# Altium schematic sheet HDMI.SchDoc
size A2; SheetNumber: 6; SheetTotal: 19
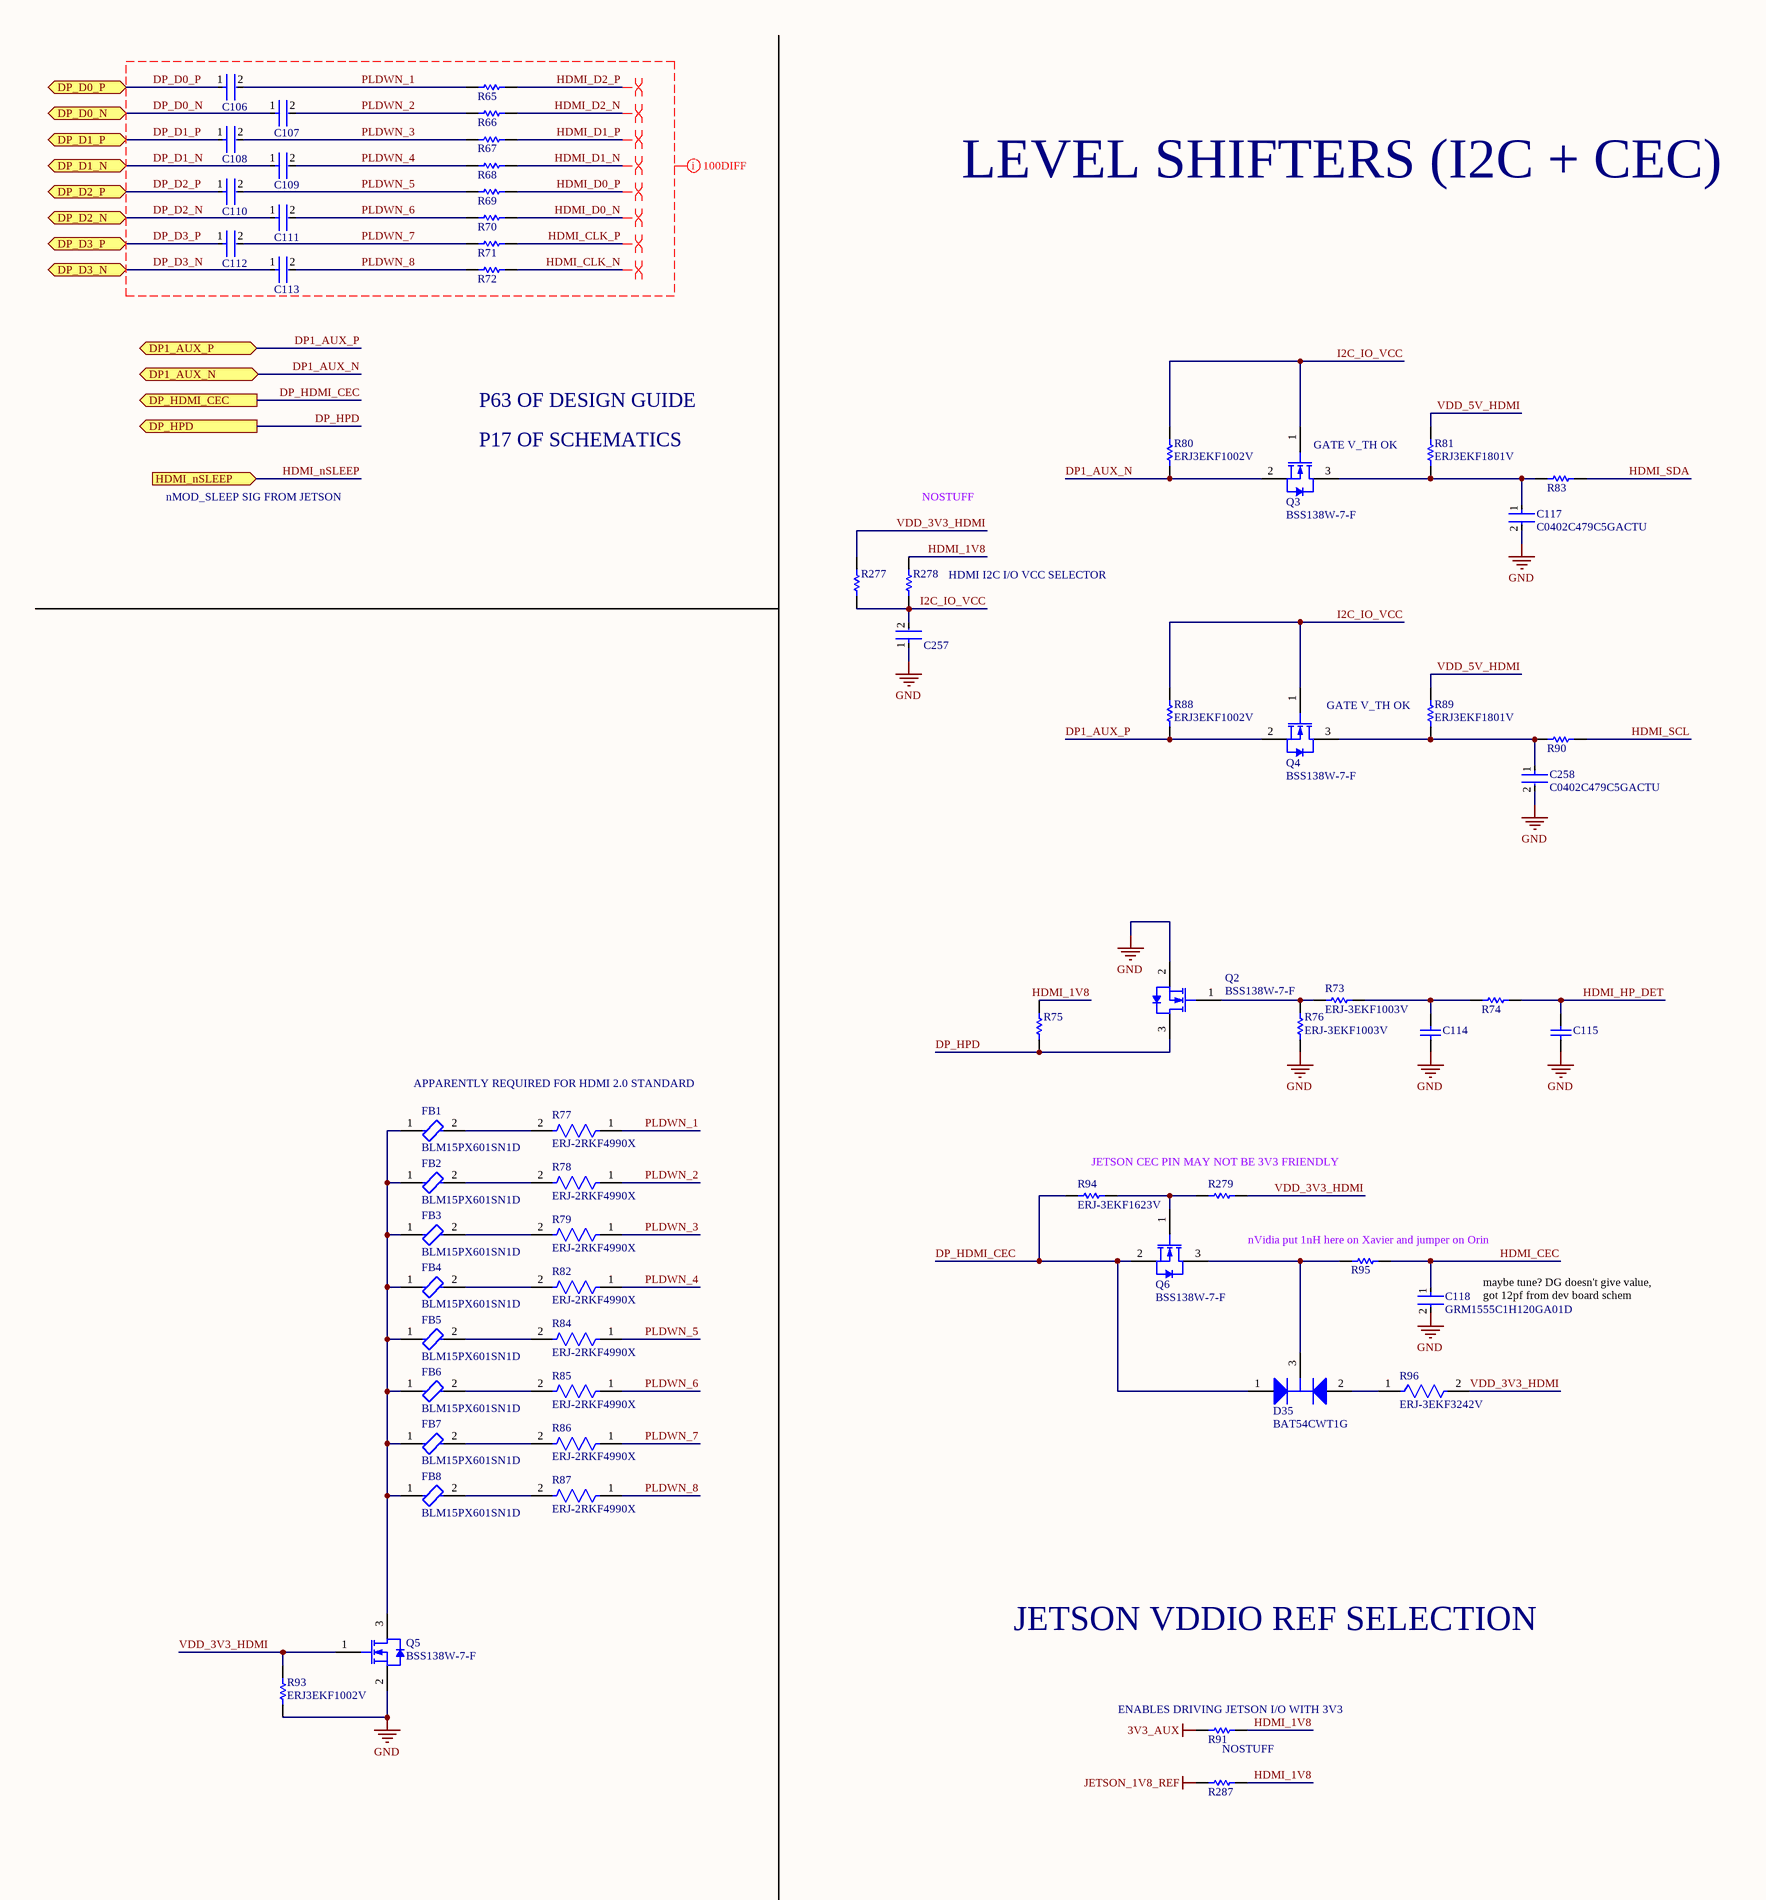
[diagram p0: HDMI.SchDoc, left]
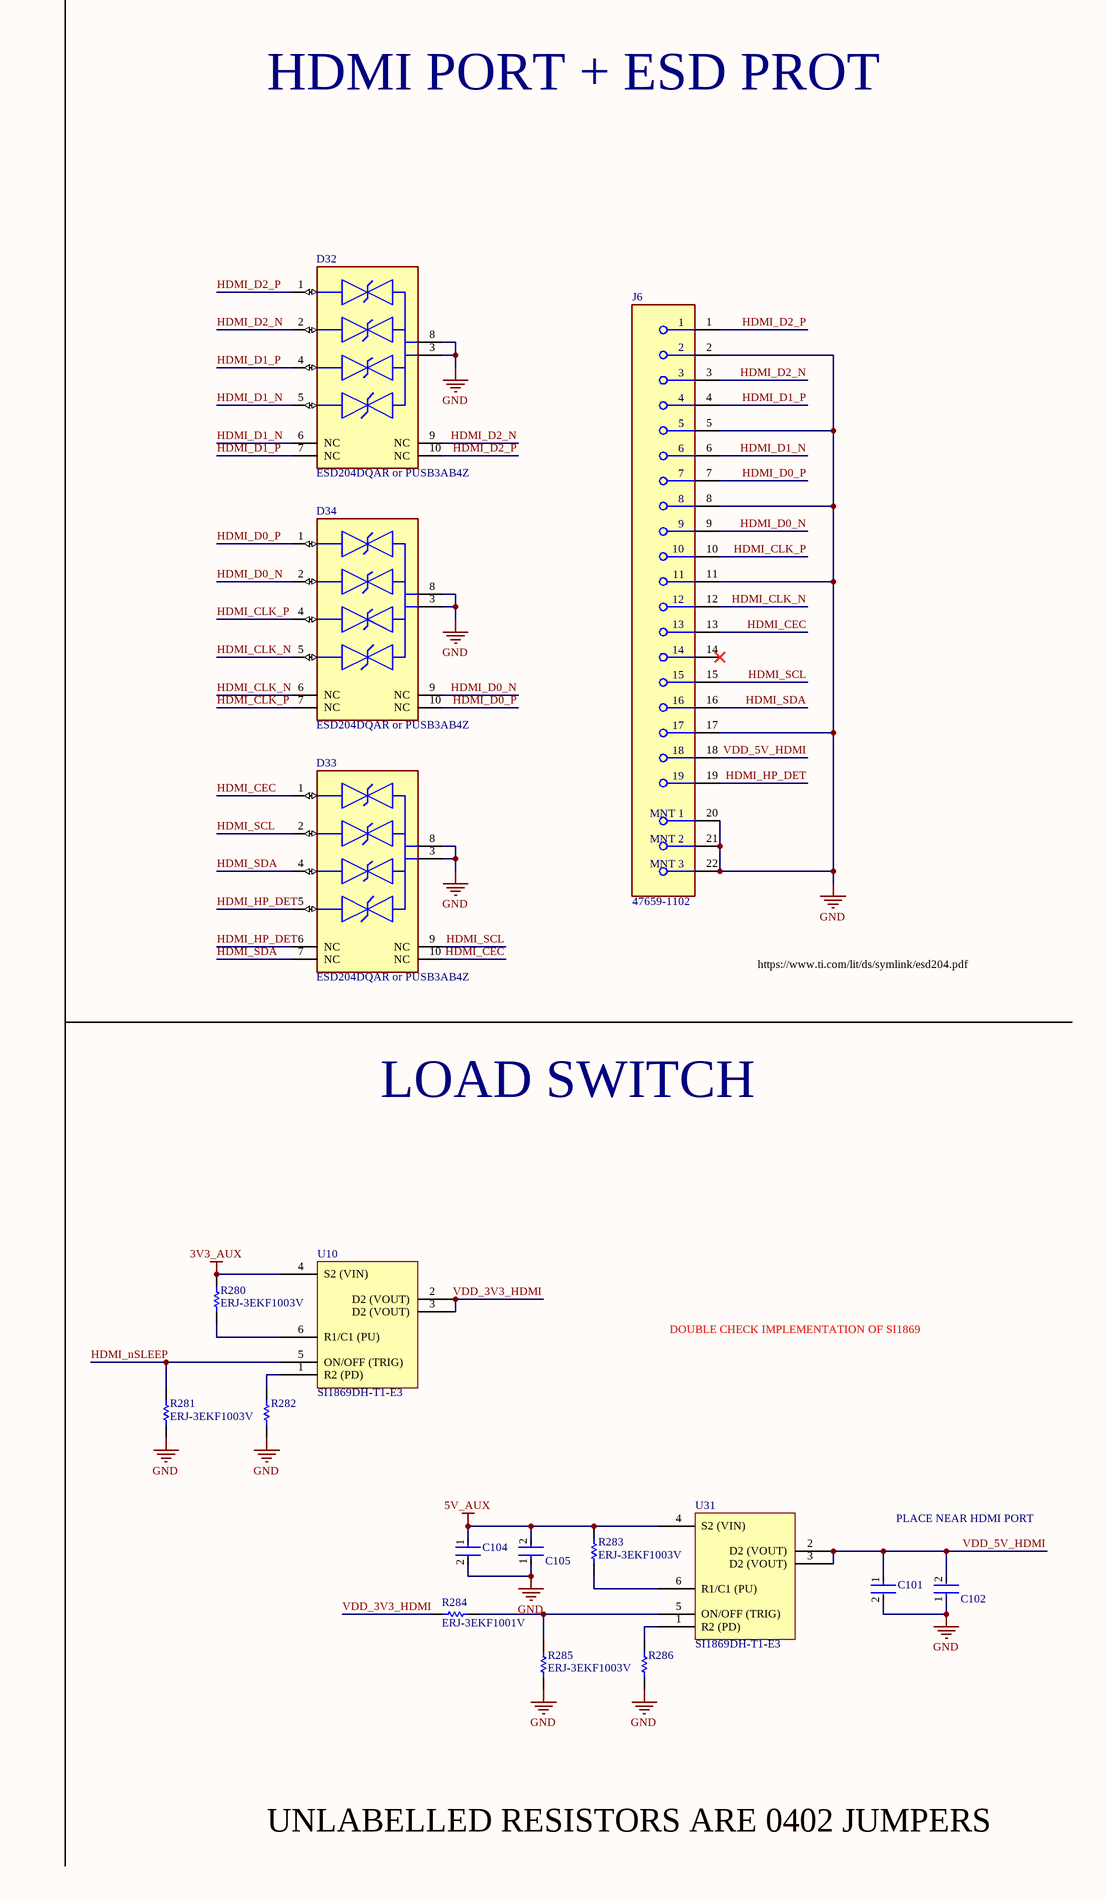
[diagram p1: HDMI.SchDoc, right]

## Parts
C101  GRM188R60J106ME47D  [FP-GRM188-0_1-e0_2_0_55-IPC_A]  (value not drawn)
C102  C1005X7R1H104K050BB  [FP-C1005-050-0_05-IPC_C]  (value not drawn)
C104  GRM188R60J106ME47D  [FP-GRM188-0_1-e0_2_0_55-IPC_A]  (value not drawn)
C105  C1005X7R1H104K050BB  [FP-C1005-050-0_05-IPC_C]  (value not drawn)
C106  C1005X7R1H104K050BB  [FP-C1005-050-0_05-IPC_C]  (value not drawn)
C107  C1005X7R1H104K050BB  [FP-C1005-050-0_05-IPC_C]  (value not drawn)
C108  C1005X7R1H104K050BB  [FP-C1005-050-0_05-IPC_C]  (value not drawn)
C109  C1005X7R1H104K050BB  [FP-C1005-050-0_05-IPC_C]  (value not drawn)
C110  C1005X7R1H104K050BB  [FP-C1005-050-0_05-IPC_C]  (value not drawn)
C111  C1005X7R1H104K050BB  [FP-C1005-050-0_05-IPC_C]  (value not drawn)
C112  C1005X7R1H104K050BB  [FP-C1005-050-0_05-IPC_C]  (value not drawn)
C113  C1005X7R1H104K050BB  [FP-C1005-050-0_05-IPC_C]  (value not drawn)
C114  C0402C221K5RAC7867  [CAPC1005X60X30NL05T10]  (value not drawn)
C115  C0402C221K5RAC7867  [CAPC1005X60X30NL05T10]  (value not drawn)
C117  C0402C479C5GACTU  [FP-C0402-BB-MFG]
C118  GRM1555C1H120GA01D  [FP-GRM155-0_05-MFG]
C257  C1005X7R1H104K050BB  [FP-C1005-050-0_05-IPC_C]  (value not drawn)
C258  C0402C479C5GACTU  [FP-C0402-BB-MFG]
D32  ESD204DQAR or PUSB3AB4Z  [FP-DQA0010A-MFG]
D33  ESD204DQAR or PUSB3AB4Z  [FP-DQA0010A-MFG]
D34  ESD204DQAR or PUSB3AB4Z  [FP-DQA0010A-MFG]
D35  BAT54CWT1G  [ONSC-SOT-323-3-419-04_V]
FB1  BLM15PX601SN1D  [FP-BLM15-0_05-MFG]
FB2  BLM15PX601SN1D  [FP-BLM15-0_05-MFG]
FB3  BLM15PX601SN1D  [FP-BLM15-0_05-MFG]
FB4  BLM15PX601SN1D  [FP-BLM15-0_05-MFG]
FB5  BLM15PX601SN1D  [FP-BLM15-0_05-MFG]
FB6  BLM15PX601SN1D  [FP-BLM15-0_05-MFG]
FB7  BLM15PX601SN1D  [FP-BLM15-0_05-MFG]
FB8  BLM15PX601SN1D  [FP-BLM15-0_05-MFG]
J6  47659-1102  [FP-47659-1102-MFG]
Q2  BSS138W-7-F  [DIOD-SOT323-3_V]
Q3  BSS138W-7-F  [DIOD-SOT323-3_V]
Q4  BSS138W-7-F  [DIOD-SOT323-3_V]
Q5  BSS138W-7-F  [DIOD-SOT323-3_V]
Q6  BSS138W-7-F  [DIOD-SOT323-3_V]
R65  0402 JUMPER  [RESC1005X40X25ML05T05]  (value not drawn)
R66  0402 JUMPER  [RESC1005X40X25ML05T05]  (value not drawn)
R67  0402 JUMPER  [RESC1005X40X25ML05T05]  (value not drawn)
R68  0402 JUMPER  [RESC1005X40X25ML05T05]  (value not drawn)
R69  0402 JUMPER  [RESC1005X40X25ML05T05]  (value not drawn)
R70  0402 JUMPER  [RESC1005X40X25ML05T05]  (value not drawn)
R71  0402 JUMPER  [RESC1005X40X25ML05T05]  (value not drawn)
R72  0402 JUMPER  [RESC1005X40X25ML05T05]  (value not drawn)
R73  ERJ-3EKF1003V  [RESC1608X55X30ML15T15]
R74  0402 JUMPER  [RESC1005X40X25ML05T05]  (value not drawn)
R75  ERJ3EKF1002V  [RESC1609X55X30LL15T15]  (value not drawn)
R76  ERJ-3EKF1003V  [RESC1608X55X30ML15T15]
R77  ERJ-2RKF4990X  [FP-ERJ2RK-MFG]
R78  ERJ-2RKF4990X  [FP-ERJ2RK-MFG]
R79  ERJ-2RKF4990X  [FP-ERJ2RK-MFG]
R80  ERJ3EKF1002V  [RESC1609X55X30LL15T15]
R81  ERJ3EKF1801V  [RESC1608X55X30LL15T15]
R82  ERJ-2RKF4990X  [FP-ERJ2RK-MFG]
R83  0402 JUMPER  [RESC1005X40X25ML05T05]  (value not drawn)
R84  ERJ-2RKF4990X  [FP-ERJ2RK-MFG]
R85  ERJ-2RKF4990X  [FP-ERJ2RK-MFG]
R86  ERJ-2RKF4990X  [FP-ERJ2RK-MFG]
R87  ERJ-2RKF4990X  [FP-ERJ2RK-MFG]
R88  ERJ3EKF1002V  [RESC1609X55X30LL15T15]
R89  ERJ3EKF1801V  [RESC1608X55X30LL15T15]
R90  0402 JUMPER  [RESC1005X40X25ML05T05]  (value not drawn)
R91  0402 JUMPER  [RESC1005X40X25ML05T05]  (value not drawn)
R93  ERJ3EKF1002V  [RESC1609X55X30LL15T15]
R94  ERJ-3EKF1623V  [RESC1608X55X30ML15T15]
R95  0402 JUMPER  [RESC1005X40X25ML05T05]  (value not drawn)
R96  ERJ-3EKF3242V  [FP-ERJ3EK-MFG]
R277  0402 JUMPER  [RESC1005X40X25ML05T05]  (value not drawn)
R278  0402 JUMPER  [RESC1005X40X25ML05T05]  (value not drawn)
R279  0402 JUMPER  [RESC1005X40X25ML05T05]  (value not drawn)
R280  ERJ-3EKF1003V  [RESC1608X55X30ML15T15]
R281  ERJ-3EKF1003V  [RESC1608X55X30ML15T15]
R282  0402 JUMPER  [RESC1005X40X25ML05T05]  (value not drawn)
R283  ERJ-3EKF1003V  [RESC1608X55X30ML15T15]
R284  ERJ-3EKF1001V  [RESC1608X55X30LL15T15]
R285  ERJ-3EKF1003V  [RESC1608X55X30ML15T15]
R286  0402 JUMPER  [RESC1005X40X25ML05T05]  (value not drawn)
R287  0402 JUMPER  [RESC1005X40X25ML05T05]  (value not drawn)
U10  SI1869DH-T1-E3  [SOT65P242X110-6N]
U31  SI1869DH-T1-E3  [SOT65P242X110-6N]

## Ports
DP1_AUX_N (bidir, see VISION_BETA_EBB[6C], JETSON[9C]), DP1_AUX_P (bidir, see VISION_BETA_EBB[6C], JETSON[9C]), DP_D0_N (bidir, see VISION_BETA_EBB[6C]), DP_D0_P (bidir, see VISION_BETA_EBB[6C]), DP_D1_N (bidir, see VISION_BETA_EBB[6C]), DP_D1_P (bidir, see VISION_BETA_EBB[6C]), DP_D2_N (bidir, see VISION_BETA_EBB[6C]), DP_D2_P (bidir, see VISION_BETA_EBB[6C]), DP_D3_N (bidir, see VISION_BETA_EBB[6C]), DP_D3_P (bidir, see VISION_BETA_EBB[6C]), DP_HDMI_CEC (out, see VISION_BETA_EBB[6C], JETSON[9C]), DP_HPD (out, see VISION_BETA_EBB[6C]), HDMI_nSLEEP (in, see VISION_BETA_EBB[6C])

## Nets
3V3_AUX: R91.1 R280.2 U10.4(S2_(VIN))
5V_AUX: C104.1 C105.2 R283.2 U31.4(S2_(VIN))
GND: C101.2 C102.1 C104.2 C105.1 C114.1 C115.1 C117.2 C118.2 C257.1 C258.2 D32.3(GND) D32.8(GND) D33.3(GND) D33.8(GND) D34.3(GND) D34.8(GND) J6.2 J6.5 J6.8 J6.11 J6.17 J6.20(MNT_1) J6.21(MNT_2) J6.22(MNT_3) Q2.2(S) Q5.2(S) R76.1 R93.1 R281.1 R282.2 R285.1 R286.2
JETSON_1V8_REF: R287.1
DP1_AUX_N: Q3.2(S) R80.1 ; port DP1_AUX_N
DP1_AUX_P: Q4.2(S) R88.1 ; port DP1_AUX_P
DP_D0_N: C107.1 ; port DP_D0_N
DP_D0_P: C106.1 ; port DP_D0_P
DP_D1_N: C109.1 ; port DP_D1_N
DP_D1_P: C108.1 ; port DP_D1_P
DP_D2_N: C111.1 ; port DP_D2_N
DP_D2_P: C110.1 ; port DP_D2_P
DP_D3_N: C113.1 ; port DP_D3_N
DP_D3_P: C112.1 ; port DP_D3_P
DP_HDMI_CEC: D35.1(A1) Q6.2(S) R94.1 ; port DP_HDMI_CEC
DP_HPD: Q2.3(D) R75.1 ; port DP_HPD
HDMI_1V8: R75.2 R91.2 R278.2 R287.2
HDMI_CEC: C118.1 D33.1(IO1) D33.10(NC) J6.13 R95.2
HDMI_CLK_N: D34.5(IO4) D34.6(NC) J6.12 R72.2
HDMI_CLK_P: D34.4(IO3) D34.7(NC) J6.10 R71.2
HDMI_D0_N: D34.2(IO2) D34.9(NC) J6.9 R70.2
HDMI_D0_P: D34.1(IO1) D34.10(NC) J6.7 R69.2
HDMI_D1_N: D32.5(IO4) D32.6(NC) J6.6 R68.2
HDMI_D1_P: D32.4(IO3) D32.7(NC) J6.4 R67.2
HDMI_D2_N: D32.2(IO2) D32.9(NC) J6.3 R66.2
HDMI_D2_P: D32.1(IO1) D32.10(NC) J6.1 R65.2
HDMI_HP_DET: C115.2 D33.5(IO4) D33.6(NC) J6.19 R74.2
HDMI_nSLEEP: R281.2 U10.5(ON/OFF_(TRIG)) ; port HDMI_nSLEEP
HDMI_SCL: D33.2(IO2) D33.9(NC) J6.15 R90.2
HDMI_SDA: D33.4(IO3) D33.7(NC) J6.16 R83.2
I2C_IO_VCC: C257.2 Q3.1(G) Q4.1(G) R80.2 R88.2 R277.1 R278.1
PLDWN_1: C106.2 R65.1 R77.1
PLDWN_2: C107.2 R66.1 R78.1
PLDWN_3: C108.2 R67.1 R79.1
PLDWN_4: C109.2 R68.1 R82.1
PLDWN_5: C110.2 R69.1 R84.1
PLDWN_6: C111.2 R70.1 R85.1
PLDWN_7: C112.2 R71.1 R86.1
PLDWN_8: C113.2 R72.1 R87.1
VDD_3V3_HDMI: Q5.1(G) R93.2 R96.2 R277.2 R279.1 R284.1 U10.2(D2_(VOUT)) U10.3(D2_(VOUT))
VDD_5V_HDMI: C101.1 C102.2 J6.18 R81.2 R89.2 U31.2(D2_(VOUT)) U31.3(D2_(VOUT))
NetC114_2: C114.2 R73.2 R74.1
NetC117_1: C117.1 Q3.3(D) R81.1 R83.1
NetC258_1: C258.1 Q4.3(D) R89.1 R90.1
NetD35_2: D35.2(A2) R96.1
NetD35_3: D35.3(K) Q6.3(D) R95.1
NetFB1_1: FB1.1 FB2.1 FB3.1 FB4.1 FB5.1 FB6.1 FB7.1 FB8.1 Q5.3(D)
NetFB1_2: FB1.2 R77.2
NetFB2_2: FB2.2 R78.2
NetFB3_2: FB3.2 R79.2
NetFB4_2: FB4.2 R82.2
NetFB5_2: FB5.2 R84.2
NetFB6_2: FB6.2 R85.2
NetFB7_2: FB7.2 R86.2
NetFB8_2: FB8.2 R87.2
NetQ2_1: Q2.1(G) R73.1 R76.2
NetQ6_1: Q6.1(G) R94.2 R279.2
NetR280_1: R280.1 U10.6(R1/C1_(PU))
NetR282_1: R282.1 U10.1(R2_(PD))
NetR283_1: R283.1 U31.6(R1/C1_(PU))
NetR284_2: R284.2 R285.2 U31.5(ON/OFF_(TRIG))
NetR286_1: R286.1 U31.1(R2_(PD))

Not connected (* = marked no-connect by the designer): J6 14*

## Layout directives
differential pair; differential pair class 100DIFF: HDMI_CLK_N, HDMI_CLK_P, HDMI_D0_N, HDMI_D0_P, HDMI_D1_N, HDMI_D1_P, HDMI_D2_N, HDMI_D2_P
net class 100DIFF: DP_D0_N, DP_D0_P, DP_D1_N, DP_D1_P, DP_D2_N, DP_D2_P, DP_D3_N, DP_D3_P, HDMI_CLK_N, HDMI_CLK_P, HDMI_D0_N, HDMI_D0_P, HDMI_D1_N, HDMI_D1_P, HDMI_D2_N, HDMI_D2_P, PLDWN_1, PLDWN_2, PLDWN_3, PLDWN_4, PLDWN_5, PLDWN_6, PLDWN_7, PLDWN_8

## Notes on the sheet
- HDMI PORT + ESD PROT
- LEVEL SHIFTERS (I2C + CEC)
- P63 OF DESIGN GUIDE
- nMOD_SLEEP SIG FROM JETSON
- P17 OF SCHEMATICS
- NOSTUFF
- (near Q3) GATE V_TH OK
- HDMI I2C I/O VCC SELECTOR
- (near Q4) GATE V_TH OK
- APPARENTLY REQUIRED FOR HDMI 2.0 STANDARD
- https://www.ti.com/lit/ds/symlink/esd204.pdf
- JETSON CEC PIN MAY NOT BE 3V3 FRIENDLY
- LOAD SWITCH
- (near R95) nVidia put 1nH here on Xavier and jumper on Orin
- maybe tune? DG doesn't give value, got 12pf from dev board schem
- DOUBLE CHECK IMPLEMENTATION OF SI1869
- JETSON VDDIO REF SELECTION
- PLACE NEAR HDMI PORT
- (near R91) ENABLES DRIVING JETSON I/O WITH 3V3
- (near R91) NOSTUFF
- UNLABELLED RESISTORS ARE 0402 JUMPERS

## Library data of the parts
C101 C104 = CMP-2006-02792-2: Chip Multilayer Ceramic Capacitors for General Purpose, 0603, 10uF, X5R, 15%, 20%, 6.3V; Packaging: Tape and Reel; Voltage Rating (DC): 6.3V; Width: 0.031inch; Termination: SMD/SMT; Dielectric: X5R; Package Quantity: 4000; Voltage Rating: 6.3V; Capacitance: 10uF; Case/Package: 0603; Min Operating Temperature: -55°C; Voltage: 6.3V; Length: 1.6mm; Thickness: 0.035inch; Lead Free: Lead Free; Depth: 0.8mm; Case Code (Imperial): 0603; Max Operating Temperature: 85°C; Material: Ceramic; Height: 0.8mm; Tolerance: 20%; Mount: Surface Mount; REACH SVHC: No SVHC; Radiation Hardening: No; Case Code (Metric): 1608
C102 C105-C113 C257 = CMP-2000-05393-2: Multilayer Ceramic Capacitors 100nF ±10% 50V X7R SMD 0402; Voltage: 50V; Dielectric Material: Ceramic; Min Operating Temperature: -55°C; Depth: 0.5mm; Radiation Hardening: No; RoHS Compliant: Yes; Voltage Rating (DC): 50V; Lead Free: Lead Free; Resistor Type: Ceramic; Height: 0.5mm; Dielectric: X7R; Thickness: 0.022inch; Case/Package: 0402; Case Code (Metric): 1005; Termination: SMD/SMT; Capacitance: 100nF; Packaging: Tape and Reel; Max Operating Temperature: 125°C; Mount: Surface Mount; Package Quantity: 1; Width: 0.02inch; Weight: 2.3E-05oz; Voltage Rating: 50V; Tolerance: 10%; Construction: Flat; Case Code (Imperial): 0402; Length: 1mm; REACH SVHC: No SVHC; Series: C
C114 C115 = CMP-2008-03137-2: Manufacturer: Kemet; Part Number: C0402C221K5RAC7867
C117 C258 = CMP-2008-03310-2: CAP CER 4.7PF 50V NP0 0402; Manufacturer: Kemet; Material: Ceramic; Tolerance: 0.25 pF; Temperature Coefficient: 15%; Temperature Characteristic: C0G; Manufacturer Part Number: C0402C479C5GACTU; Lead Free: Yes; Device Class L1: Passive Components; ComponentLink2Description: Datasheet; Temperature: -55°C to +125°C; Digikey Description: CAP CER 4.7PF 50V NP0 0402; Ipc Land Pattern Name: CAPC10050X50; ComponentLink2URL: https://content.kemet.com/datasheets/KEM_C1002_X7R_SMD.pdf; Octopart: https://octopart.com/c0402c479c5gactu-kemet-9144199; Mouser Description: Multilayer Ceramic Capacitors MLCC - SMD/SMT 50volts 4.7pF C0G .25pF; Automotive: No; Voltage Rating: 50 V; Device Class L3: Ceramic Capacitors; Capacitance: 4.7 pF; Category: Cap; Value: 4.7 pF; Package: C0402-BB; Height: 0.55mm; Temperature Range Low: -55°C; RoHS: TRUE; Device Class L2: Capacitors; Temperature Range High: +125°C
C118 = CMP-2008-03945-2: CAP CER 12PF 50V C0G/NP0 0402; Tolerance: 2%; Dielectric: C0G; Material: Ceramic; Termination: SMD/SMT; Mount: Surface Mount; REACH SVHC: No SVHC; Depth: 0.5mm; Case Code (Metric): 1005; Voltage Rating: 50V; Height: 0.5mm; Voltage Rating (DC): 50V; Case Code (Imperial): 0402; Package Quantity: 10000; Construction: Flat; Thickness: 0.022inch; Length: 1mm; Min Operating Temperature: -55°C; Width: 0.5mm; Lead Free: Lead Free; Capacitance: 12pF; Case/Package: 0402; Packaging: Tape and Reel; Series: GRM; Voltage: 50V; Radiation Hardening: No; Max Operating Temperature: 125°C
D32-D34 = CMP-04989-000002-1: 4-CHANNEL LOW-CAPACITANCE SURGE; Manufacturer: Texas Instruments; Value: 0.55pF; Reverse Standoff Voltage: 3.6V; Standoff Height: 0mm; Breakdown Voltage: 5.5V; Peak Pulse Current: 5.5A; Clamping Voltage: 11.5V; Direction: Bidirectional; Peak Pulse Power: 50W; Number Of Channels: 4; Ambient Temperature Range High: +125°C; ComponentLink2Description: Datasheet; Height: 0.55mm; Lead Free: Yes; Device Class L3: unset; Temperature Range High: +125°C; Temperature Range Low: -40°C; Package: DQA0010A; Temperature: -40°C to +125°C; Capacitance: 0.55pF; RoHS: TRUE; Mouser Description: 4-Channel Low-Capacitance Surge and ESD Protection Diode 10-USON -40 to 125; Category: Diode; Device Class L1: Circuit Protection; Octopart: https://octopart.com/esd204dqar-texas+instruments-89917476; Device Class L2: TVS Diodes; Ambient Temperature Range Low: -40°C; Manufacturer Part Number: ESD204DQAR; ComponentLink2URL: http://www.ti.com/lit/ds/symlink/esd204.pdf; Automotive: No; Digikey Description: 4-CHANNEL LOW-CAPACITANCE SURGE
D35 = CMP-1055-00557-1: Dual Series Cathode Schottky Barrier Diodes, 3-Pin SOT-323, Pb-Free, Tape and Reel; Manufacturer: On Semiconductor; Configuration: Common Cathode; IFSM Max (A): 0.6; trr Max (ns): 5; ComponentLink2Description: Datasheet; Packing: Tape and Reel; ComponentLink3Description: Package Specification; Mounting Technology: Surface Mount; PartNumber: BAT54CWT1G; PackageVersion: Rev. N, 11/2008; RoHS: TRUE; ComponentLink3URL: http://www.onsemi.com/pub_link/Collateral/419-04.PDF; ComponentLink2URL: http://www.onsemi.cn/pub_link/Collateral/BAT54CWT1-D.PDF; PackageReference: SOT-323-3-419-04; ComponentLink1URL: http://www.onsemi.com/; ComponentLink1Description: Manufacturer URL; DatasheetVersion: Rev. 7; PackageDescription: 3-Pin Small Outline Transistor, Body 2 x 1.25 mm, Pitch 0.65 mm
FB1-FB8 = CMP-0686-00252-4: Chip Ferrite Bead, 0402, 600Ω @ 100MHz, 0.23Ω, 25%, 900mA; Number of Circuits: 1; Impedance: 600R; DC Resistance (DCR): 230mR; Material: Steel; Length: 1mm; Package Quantity: 10000; Height: 0.5mm; Width: 0.5mm; Max DC Current: 900mA; Number of Lines: 1; Termination: SMD/SMT; Packaging: Tape and Reel; Lead Free: Lead Free; Min Operating Temperature: -55°C; Max Operating Temperature: 125°C; Max Current Rating: 900mA; Case Code (Imperial): 0402; Number of Pins: 2; Current Rating: 900mA; Test Frequency: 100MHz; Case/Package: 0402; Tolerance: 25%; Case Code (Metric): 1005
J6 = CMP-04768-000010-1: HDMI REC.VERTICAL SMT TYPE W/HEI; RoHS Compliant: Yes
Q2-Q6 = CMP-2000-05968-1: N-Channel Enhancement Mode Mosfet, 50 V, 200 mA, -55 to 150 degC, 6-Pin SOT-323, RoHS, Tape and Reel; Typical Turn-Off Delay Time: 20ns; Number of Channels: 1Channel; Type: EnhancementModeFieldEffectTransistor; Brand: DiodesIncorporated; Vds - Drain-Source Breakdown Voltage: 75V; Vgs - Gate-Source Voltage: 20V; Rds On - Drain-Source Resistance: 1.4Ohms; Transistor Type: 1N-Channel; Configuration: Single; Unit Weight: 0.000212oz; Pd - Power Dissipation: 200mW; Id - Continuous Drain Current: 200mA; Forward Transconductance - Min: 0.1S; Manufacturer URL: http://www.diodes.com/; Series: BSS138; Package Description: 3-Pin Small Outline Transistor, Body 2 x 1.25 mm, Pitch 0.65 mm; Mounting Technology: SurfaceMount; Product Category: MOSFET; RoHS: True; Maximum Operating Temperature: +150C; Height: 1mm; Length: 2.2mm; Technology: Si; Width: 1.35mm; Datasheet URL: http://www.diodes.com/_files/datasheets/ds30206.pdf; Manufacturer: DiodesIncorporated; Package / Case: SOT-323-3; Typical Turn-On Delay Time: 20ns; Transistor Polarity: N-Channel; Factory Pack Quantity: 3000; Packaging: Reel; Product: MOSFETSmallSignal; Datasheet Version: Rev. 11-2, 09/2013; Package Reference: SOT323; Minimum Operating Temperature: -55C; Mounting Style: SMD/SMT; Channel Mode: Enhancement
R65-R72 R74 R83 R90 R91 R95 R277-R279 R282 R286 R287 = CMP-009-00118-2: READ THE NAME; Pins: 2; Component Type: Standard; Design Item ID: CMP-009-00206-2; Source: 0402jump.SchLib
R73 R76 R280 R281 R283 R285 = CMP-2000-00182-1: Manufacturer: Panasonic; Part Number: ERJ-3EKF1003V
R75 R80 R88 R93 = CMP-1012-00623-3: Chip Resistor, 10 KOhm, +/- 1%, 0.1 W, -55 to 155 degC, 0603 (1608 Metric), RoHS, Tape and Reel; Manufacturer: Panasonic; Voltage Rating: 75V; Case\/Package: 0603; Power Rating: 100mW; Resistance: 10KOhm; Temperature Coefficient: 100ppm\/degreesC; Number of Pins: 2; Package Reference: 603; Depth: 0.8mm; Mount: SurfaceMount; Package Description: 2-Pin Surface Mount Device, Body 1.6 x 0.85 mm; Datasheet Version: 02/2017; Length: 1.6mm; Lead Free: LeadFree; Height: 0.45mm; Number of Terminations: 2; Max Power Dissipation: 100mW; Min Operating Temperature: -55degC; Datasheet URL: https://industrial.panasonic.com/cdbs/www-data/pdf/RDA0000/AOA0000C304.pdf; Termination: SMD/SMT; Case Code (Metric): 1608; Case Code (Imperial): 0603; Tolerance: 1%; Max Operating Temperature: 155degC; RoHSCompliant: true; Voltage Rating (DC): 75V; Radiation Hardening: No; Packaging: TapeandReel; Composition: ThickFilm; Mounting Technology: SurfaceMount; Manufacturer URL: http://www.panasonic.com/; Width: 0.031inch; REACH SVHC: NoSVHC; Contact Plating: Tin; Military Standard: Not; Package Quantity: 1
R77-R79 R82 R84-R87 = CMP-2002-00965-2: RES SMD 499 OHM 1% 1/10W 0402; Temperature Coefficient: 100ppm/°C; Max Power Dissipation: 100mW; Voltage Rating (DC): 50V; Resistance: 499R; Technology: THICK FILM; Min Operating Temperature: -55°C; Package Quantity: 1; Width: 0.02inch; Contact Plating: Tin; Tolerance: 1%; Features: Automotive AEC-Q200; Resistance Tolerance: 1%; Size Code: 0402; Military Standard: Not; Resistor Type: Thick Film; Case/Package: 0402; Mount: Surface Mount; Case Code (Metric): 1005; RoHS Compliant: Yes; REACH SVHC: No SVHC; Number of Terminations: 2; Construction: Rectangular; Packaging: Tape and Reel; Series: ERJ; Lead Free: Lead Free; Length: 1mm; Voltage Rating: 50V; Termination: SMD/SMT; Max Operating Temperature: 155°C; Case Code (Imperial): 0402; Height: 0.35mm; Power Rating: 100mW; Depth: 0.5mm
R81 R89 = CMP-2000-00389-1: MODIFIED P/N; Manufacturer: Panasonic; Part Number: ERJ3EKF2701V
R94 = CMP-1012-00758-2: Manufacturer: Panasonic; Part Number: ERJ-3EKF1623V
R96 = CMP-2000-00433-2: RES SMD 32.4K OHM 1% 1/10W 0603; Voltage Rating: 75V; Max Power Dissipation: 100mW; Temperature Coefficient: 100ppm/°C; Resistance: 32.4kR; Voltage Rating (DC): 50V; Technology: THICK FILM; Tolerance: 1%; Features: Automotive AEC-Q200; Width: 0.8mm; Case/Package: 0603; Min Operating Temperature: -55°C; Power Rating: 100mW; Contact Plating: Tin; Case Code (Imperial): 0603; Number of Terminations: 2; Lead Free: Lead Free; Length: 1.6mm; Series: ERJ; Packaging: Tape and Reel; RoHS Compliant: Yes; Military Standard: Not; Termination: SMD/SMT; Case Code (Metric): 1608; Max Operating Temperature: 155°C; Package Quantity: 1; Mount: Surface Mount; Resistor Type: Thick Film; Construction: Rectangular; Height: 0.45mm; Resistance Tolerance: 1%; Depth: 0.8mm; Radiation Hardening: No
R284 = CMP-2000-00180-1: Manufacturer: Panasonic; Part Number: ERJ-3EKF1001V
U10 U31 = CMP-019-00043-2: Power Supply Support Circuit, Adjustable, 1 Channel, PDSO6; Max Supply Voltage: 20V; Min Supply Voltage: 1.8V; Case/Package: TSSOP; Pins: 6; RoHS Compliant: Yes